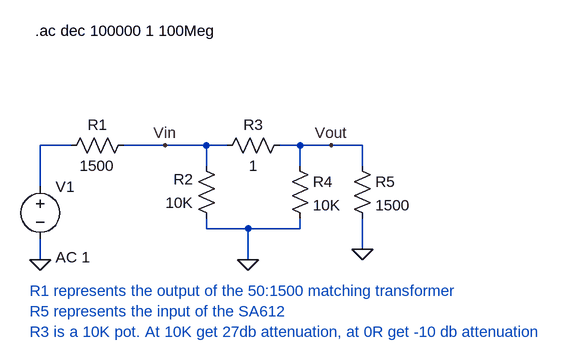
[diagram p0: schematic RF Preamp Gain Contro Testl.asc]
RF Preamp Gain Contro Testl.asc, the LTspice schematic file:
Version 4
SHEET 1 988 680
WIRE 112 96 64 96
WIRE 256 96 192 96
WIRE 320 96 256 96
WIRE 352 96 320 96
WIRE 464 96 432 96
WIRE 512 96 464 96
WIRE 560 96 512 96
WIRE 320 128 320 96
WIRE 464 128 464 96
WIRE 560 128 560 96
WIRE 64 160 64 96
WIRE 320 224 320 208
WIRE 384 224 320 224
WIRE 464 224 464 208
WIRE 464 224 384 224
WIRE 560 256 560 208
WIRE 64 272 64 240
WIRE 384 272 384 224
FLAG 64 272 0
FLAG 384 272 0
FLAG 560 256 0
FLAG 256 96 Vin
FLAG 512 96 Vout
SYMBOL voltage 64 144 R0
WINDOW 123 24 124 Left 2
WINDOW 39 0 0 Left 2
SYMATTR Value2 AC 1
SYMATTR InstName V1
SYMATTR Value ""
SYMBOL res 208 80 R90
WINDOW 0 0 56 VBottom 2
WINDOW 3 32 56 VTop 2
SYMATTR InstName R1
SYMATTR Value 1500
SYMBOL res 336 224 R180
WINDOW 0 36 76 Left 2
WINDOW 3 36 40 Left 2
SYMATTR InstName R2
SYMATTR Value 10K
SYMBOL res 336 112 R270
WINDOW 0 32 56 VTop 2
WINDOW 3 0 56 VBottom 2
SYMATTR InstName R3
SYMATTR Value 1
SYMBOL res 448 112 R0
SYMATTR InstName R4
SYMATTR Value 10K
SYMBOL res 544 112 R0
SYMATTR InstName R5
SYMATTR Value 1500
TEXT 56 -80 Left 2 !.ac dec 100000 1 100Meg
TEXT 48 320 Left 2 ;R1 represents the output of the 50:1500 matching transformer\nR5 represents the input of the SA612\nR3 is a 10K pot. At 10K get 27db attenuation, at 0R get -10 db attenuation

The netlist it stands for:
* RF Preamp Gain Contro Testl.asc
V1 N001 0 AC 1
R1 Vin N001 1500
R2 0 Vin 10K
R3 Vin Vout 1
R4 Vout 0 10K
R5 Vout 0 1500
.ac dec 100000 1 100Meg
* R1 represents the output of the 50:1500 matching transformer
* R5 represents the input of the SA612
* R3 is a 10K pot. At 10K get 27db attenuation, at 0R get -10 db attenuation
.backanno
.end